# Altium schematic sheet Sata.SCHDOC: Apalis Evaluation Board 1.1
size A3; Organization: Toradex AG; Address1: Altsagenstrasse 5; Address2: Horw; Address3: 6048; Address4: Switzerland; DocumentNumber: 25; Revision: V1.1; SheetNumber: 25; SheetTotal: 32; PageSetup: Record=PageOptions|CenterHorizontal=True|CenterVertical=True|PrintScale=0.73|XCorrection=1.00|YCorrection=1.00|PrintKind=0|BorderSize=5000000|LeftOffset=0|BottomOffset=0|Orientation=2|PaperLength=1000|PaperWidth=1000|Scale=100|PaperSource=7|PrintQuality=-4|MediaType=1|DitherType=10|PaperKind=A4|PrintScaleMode=1
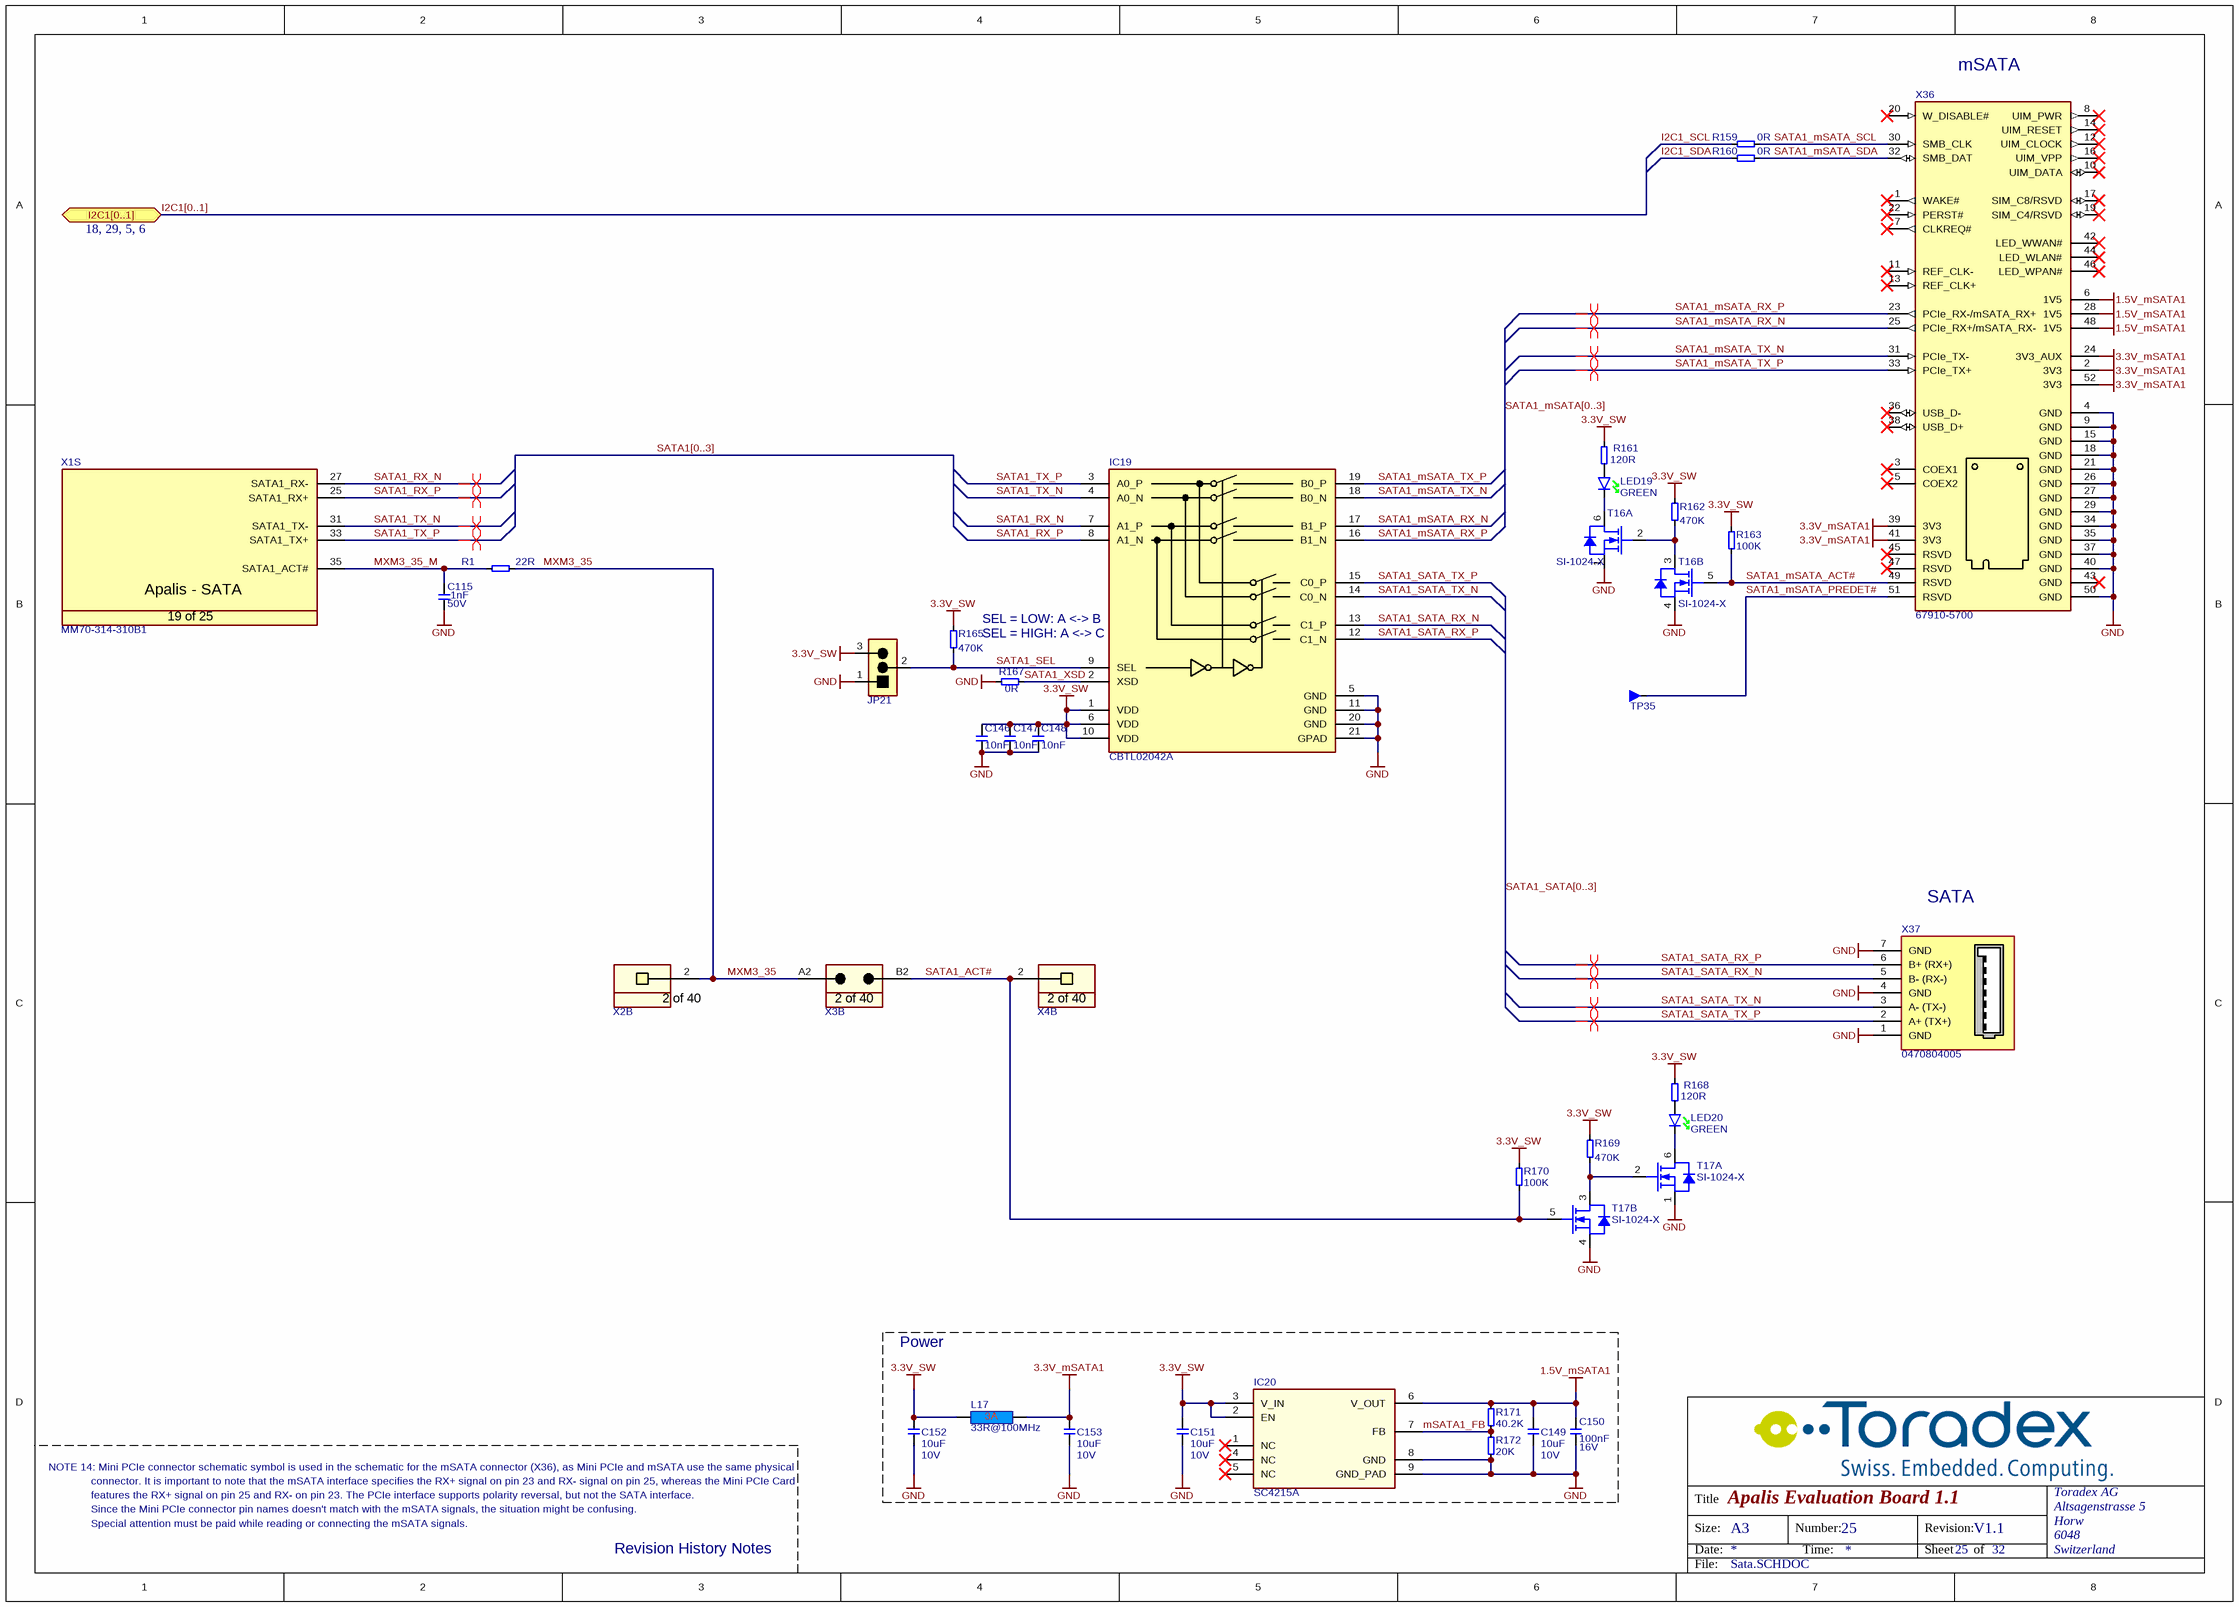
[diagram p0: Sata.SCHDOC]

## Parts
C115  Rating: 50V  [CAPC1005X60N]  (hidden comment: 1nF)
C146  10nF  [T_CAPC0603X33N]
C147  10nF  [T_CAPC0603X33N]
C148  10nF  [T_CAPC0603X33N]
C149  Rating: 10V  [T_CAPC0603X33N]  (hidden comment: 10uF)
C150  Rating: 16V  [T_CAPC0603X33N]  (hidden comment: 100nF)
C151  Rating: 10V  [T_CAPC0603X33N]  (hidden comment: 10uF)
C152  Rating: 10V  [T_CAPC0603X33N]  (hidden comment: 10uF)
C153  Rating: 10V  [T_CAPC0603X33N]  (hidden comment: 10uF)
IC19  CBTL02042A  [QFN50P250X450X100-20N]
IC20  Part No.: SC4215A  [SOIC127P650X175_HS-8N]  (hidden comment: IC-Semtech-SC4215A)
JP21  826936-3  [T_TYCO_826936-3]  (value not drawn)
L17  33R@100MHz  [INDC1608X95N]
LED19  Color: GREEN  [T_Osram_T670_GREEN]  (hidden comment: LG T670-K1L2-1)
LED20  Color: GREEN  [T_Osram_T670_GREEN]  (hidden comment: LG T670-K1L2-1)
R1  22R  [RESC1005X40N]
R159  0R  [T_RESC0603X30N]
R160  0R  [T_RESC0603X30N]
R161  120R  [T_RESC0603X30N]
R162  470K  [T_RESC0603X30N]
R163  100K  [T_RESC0603X30N]
R165  470K  [T_RESC0603X30N]
R167  0R  [T_RESC0603X30N]
R168  120R  [T_RESC0603X30N]
R169  470K  [T_RESC0603X30N]
R170  100K  [T_RESC0603X30N]
R171  40.2K  [T_RESC0603X30N]
R172  20K  [T_RESC0603X30N]
T16  Manufacturer Part No.: SI-1024-X  [SOTFL50P160X60-6N]  (hidden comment: T-Vishay-SI-1024X-N)  (parts A,B of 2)
T17  Manufacturer Part No.: SI-1024-X  [SOTFL50P160X60-6N]  (hidden comment: T-Vishay-SI-1024X-N)  (parts A,B of 2)
TP35  Testpin  [T_TP-THT]  (value not drawn)
X1  Manufacturer Part No.: MM70-314-310B1  [T_JAE_MM70-314-310B1]  (hidden comment: CON-JAE-MM70-314-310B1-314-0.5mm)  (part S of 25)
X2  SSW-110-01-G-S  [T_Samtec_SSW-110-01-G-S]  (value not drawn)  (part B of 40)
X3  TSW-110-07-G-D  [T_Samtec_TSW-110-07-G-D]  (value not drawn)  (part B of 40)
X4  SSW-110-01-G-S  [T_Samtec_SSW-110-01-G-S]  (value not drawn)  (part B of 40)
X36  67910-5700  [T_Molex_67910-5700]
X37  0470804005  [T_Molex_47080-4005]

## Blocks framed on the sheet
Power: C149-C153 IC20 L17 R171 R172

## Ports
I2C1[0..1] (bidir, see 18, 29, 5, 6)

## Nets
1.5V_mSATA1: C149.2 C150.2 IC20.6(V_OUT) R171.2 X36.6(1V5) X36.28(1V5) X36.48(1V5)
3.3V_mSATA1: C153.2 L17.2 X36.2(3V3) X36.24(3V3_AUX) X36.39(3V3) X36.41(3V3) X36.52(3V3)
3.3V_SW: C146.2 C147.2 C148.2 C151.2 C152.2 IC19.1(VDD) IC19.6(VDD) IC19.10(VDD) IC20.2(EN) IC20.3(V_IN) JP21.3 L17.1 R161.2 R162.1 R163.2 R165.1 R168.2 R169.1 R170.2
GND: C115.1 C146.1 C147.1 C148.1 C149.1 C150.1 C151.1 C152.1 C153.1 IC19.5(GND) IC19.11(GND) IC19.20(GND) IC19.21(GPAD) IC20.8(GND) IC20.9(GND_PAD) JP21.1 R167.1 R172.1 T16.1(S) T16.4(S) T17.1(S) T17.4(S) X36.4(GND) X36.9(GND) X36.15(GND) X36.18(GND) X36.21(GND) X36.26(GND) X36.27(GND) X36.29(GND) X36.34(GND) X36.35(GND) X36.37(GND) X36.40(GND) X36.50(GND) X37.1(GND) X37.4(GND) X37.7(GND)
I2C1_SCL: R159.1
I2C1_SDA: R160.1
mSATA1_FB: IC20.7(FB) R171.1 R172.2
MXM3_35: R1.2 X2.2 X3.A2
MXM3_35_M: C115.2 R1.1 X1.35(SATA1_ACT#)
SATA1_ACT#: R170.1 T17.5(G) X3.B2 X4.2
SATA1_mSATA_ACT#: R163.1 T16.5(G) X36.49(RSVD)
SATA1_mSATA_PREDET#: TP35.1 X36.51(RSVD)
SATA1_mSATA_RX_N: IC19.17(B1_P) X36.25(PCIe_RX+/mSATA_RX-)
SATA1_mSATA_RX_P: IC19.16(B1_N) X36.23(PCIe_RX-/mSATA_RX+)
SATA1_mSATA_SCL: R159.2 X36.30(SMB_CLK)
SATA1_mSATA_SDA: R160.2 X36.32(SMB_DAT)
SATA1_mSATA_TX_N: IC19.18(B0_N) X36.31(PCIe_TX-)
SATA1_mSATA_TX_P: IC19.19(B0_P) X36.33(PCIe_TX+)
SATA1_RX_N: IC19.7(A1_P) X1.27(SATA1_RX-)
SATA1_RX_P: IC19.8(A1_N) X1.25(SATA1_RX+)
SATA1_SATA_RX_N: IC19.13(C1_P) X37.5(B-_(RX-))
SATA1_SATA_RX_P: IC19.12(C1_N) X37.6(B+_(RX+))
SATA1_SATA_TX_N: IC19.14(C0_N) X37.3(A-_(TX-))
SATA1_SATA_TX_P: IC19.15(C0_P) X37.2(A+_(TX+))
SATA1_SEL: IC19.9(SEL) JP21.2 R165.2
SATA1_TX_N: IC19.4(A0_N) X1.31(SATA1_TX-)
SATA1_TX_P: IC19.3(A0_P) X1.33(SATA1_TX+)
SATA1_XSD: IC19.2(XSD) R167.2
NetLED19_A: LED19.A R161.1
NetLED19_K: LED19.K T16.6(D)
NetLED20_A: LED20.A R168.1
NetLED20_K: LED20.K T17.6(D)
NetR162_2: R162.2 T16.2(G) T16.3(D)
NetR169_2: R169.2 T17.2(G) T17.3(D)

Not connected (* = marked no-connect by the designer): IC20 1(NC)* 4(NC)* 5(NC)*; X36 1(WAKE#)* 3(COEX1)* 5(COEX2)* 7(CLKREQ#)* 8(UIM_PWR)* 10(UIM_DATA)* 11(REF_CLK-)* 12(UIM_CLOCK)* 13(REF_CLK+)* 14(UIM_RESET)* 16(UIM_VPP)* 17(SIM_C8/RSVD)* 19(SIM_C4/RSVD)* 20(W_DISABLE#)* 22(PERST#)* 36(USB_D-)* 38(USB_D+)* 42(LED_WWAN#)* 43(GND)* 44(LED_WLAN#)* 45(RSVD)* 46(LED_WPAN#)* 47(RSVD)*

## Buses and harness runs
bus I2C1[0..1] = port I2C1[0..1]
bus SATA1[0..3]
bus SATA1_mSATA[0..3]
bus SATA1_SATA[0..3]

## Layout directives
differential pair: SATA1_mSATA_RX_N, SATA1_mSATA_RX_P, SATA1_mSATA_TX_N, SATA1_mSATA_TX_P, SATA1_RX_N, SATA1_RX_P, SATA1_SATA_RX_N, SATA1_SATA_RX_P, SATA1_SATA_TX_N, SATA1_SATA_TX_P, SATA1_TX_N, SATA1_TX_P

## Notes on the sheet
- (near X36) mSATA
- (near IC19) SEL = LOW: A <-> B
- (near IC19) SEL = HIGH: A <-> C
- (near X37) SATA
- NOTE 14: Mini PCIe connector schematic symbol is used in the schematic for the mSATA connector (X36), as Mini PCIe and mSATA use the same physical
- connector. It is important to note that the mSATA interface specifies the RX+ signal on pin 23 and RX- signal on pin 25, whereas the Mini PCIe Card
- Since the Mini PCIe connector pin names doesn't match with the mSATA signals, the situation might be confusing.
- features the RX+ signal on pin 25 and RX- on pin 23. The PCIe interface supports polarity reversal, but not the SATA interface.
- Special attention must be paid while reading or connecting the mSATA signals.
- Revision History Notes
- Title
- Size:
- Date:
- A3
- Number:
- Time:
- Revision:
- Sheet
- of
- File:
- (in symbol CON-JAE-MM70-314-310B1-314-0.5mm, part S) Apalis - SATA; 19 of 25
- (in symbol CON-Samtec-SSW-110-01-G-S, part B) 2 of 40
- (in symbol CON-Samtec-TSW-110-07-G-D, part B) 2 of 40

## Library data of the parts
C115 = C-X7R-1nF-50V-10%-0402: Capacitor Ceramic X7R 1nF 50V 10% 0402; Tolerance: 10%; Type: X7R; Value: 1nF
C146-C148 = C-X7R-10nF-25V-10%-0603: Capacitor Ceramic X7R 10nF 25V 10% 0603; Tolerance: 10%; Type: X7R; Value: 10nF
C149 C151-C153 = C-X5R-10uF-10V-20%-0603: Capacitor Ceramic X5R 10uF 10V 20% 0603; Tolerance: 20%; Type: X5R; Value: 10uF
C150 = C-X7R-100nF-16V-10%-0603: Capacitor Ceramic X7R 100nF 16V 10% 0603; Tolerance: 10%; Type: X7R; Value: 100nF
IC19 = IC-NXP-CBTL02042A: Analog Switch CBTL02042A; Manufacturer Name: NXP; Manufacturer Part No.: CBTL02042A
IC20 = IC-Semtech-SC4215A: LDO TO 2A; Manufacturer Name: Semtech
JP21 = CON-Tyco-826936-3-1X3-2.54mm-JP_1: Jumper, 3-Pin; Manufacturer Name: Tyco; No. of ways: 1X3; Pitch: 2.54mm; Manufacturer Part No.: 826936-3
L17 = L-33R@100MHz-3A-25%-0603: 33R@100MHz 3A EMI FILTER; Tolerance: 25%; Rating: 3A; Value: 33R@100MHz
LED19 LED20 = LED-Osram-T670-K1L2-1: LED green Osram LG T670-K1L2-1; Manufacturer Name: Osram; Manufacturer Part No.: LG T670-K1L2-1
R1 = R-22R-63mW-5%-0402: Resistor 22 ohm 63mW 5% 0402; Rating: 63mW; Tolerance: 5%; Value: 22R
R159 R160 R167 = R-0R-63mW-1%-0603: Resistor 0 ohm 63mW 1% 0603; Rating: 63mW; Tolerance: 1%; Value: 0R
R161 R168 = R-120R-63mW-5%-0603: Resistor 120 ohm 63mW 5% 0603; Rating: 63mW; Tolerance: 5%; Value: 120R
R162 R165 R169 = R-470KR-63mW-5%-0603: Resistor 470 Kohm 63mW 5% 0603; Value: 470KR; Rating: 63mW; Tolerance: 5%
R163 R170 = R-100KR-63mW-5%-0603: Resistor 100 Kohm 63mW 5% 0603; Value: 100KR; Rating: 63mW; Tolerance: 5%
R171 = R-40.2KR-63mW-1%-0603: Resistor 40.2 Kohm 63mW 1% 0603; Value: 40.2KR; Rating: 63mW; Tolerance: 1%
R172 = R-20KR-63mW-1%-0603: Resistor 20 Kohm 63mW 1% 0603; Value: 20KR; Rating: 63mW; Tolerance: 1%
T16 T17 = T-Vishay-SI-1024X-N: Dual N-Channel 20V (D-S)  MOSFET; Manufacturer Name: Vishay
TP35 = Testpin: Testpin TH
X1 = CON-JAE-MM70-314-310B1-314-0.5mm: MXM3 Connector; Manufacturer Name: JAE; No. of ways: 314
X2 X4 = CON-Samtec-SSW-110-01-G-S: Receptacle Female Socket 1x40 pin 2.54mm pitch; Manufacturer Name: Samtec; Pitch: 2.54mm; No. of ways: 1x40; Manufacturer Part No.: SSW-110-01-G-S
X3 = CON-Samtec-TSW-110-07-G-D: Header 2x40 pin 2.54mm pitch; Manufacturer Name: Samtec; Pitch: 2.54mm; No. of ways: 2x40; Manufacturer Part No.: TSW-110-07-G-D
X36 = CON-Molex-67910-5700: PCIe_Mini Card Holder; Manufacturer Name: Molex; Part No.: 67910-5700
X37 = CON-Molex-047080-4005: Sata Plugr SMD; Manufacturer name: Molex; Manufacturer Part No.: 47080-4005